# EAGLE schematic BATT_DISP_v6 (EAGLE 9.6.2)
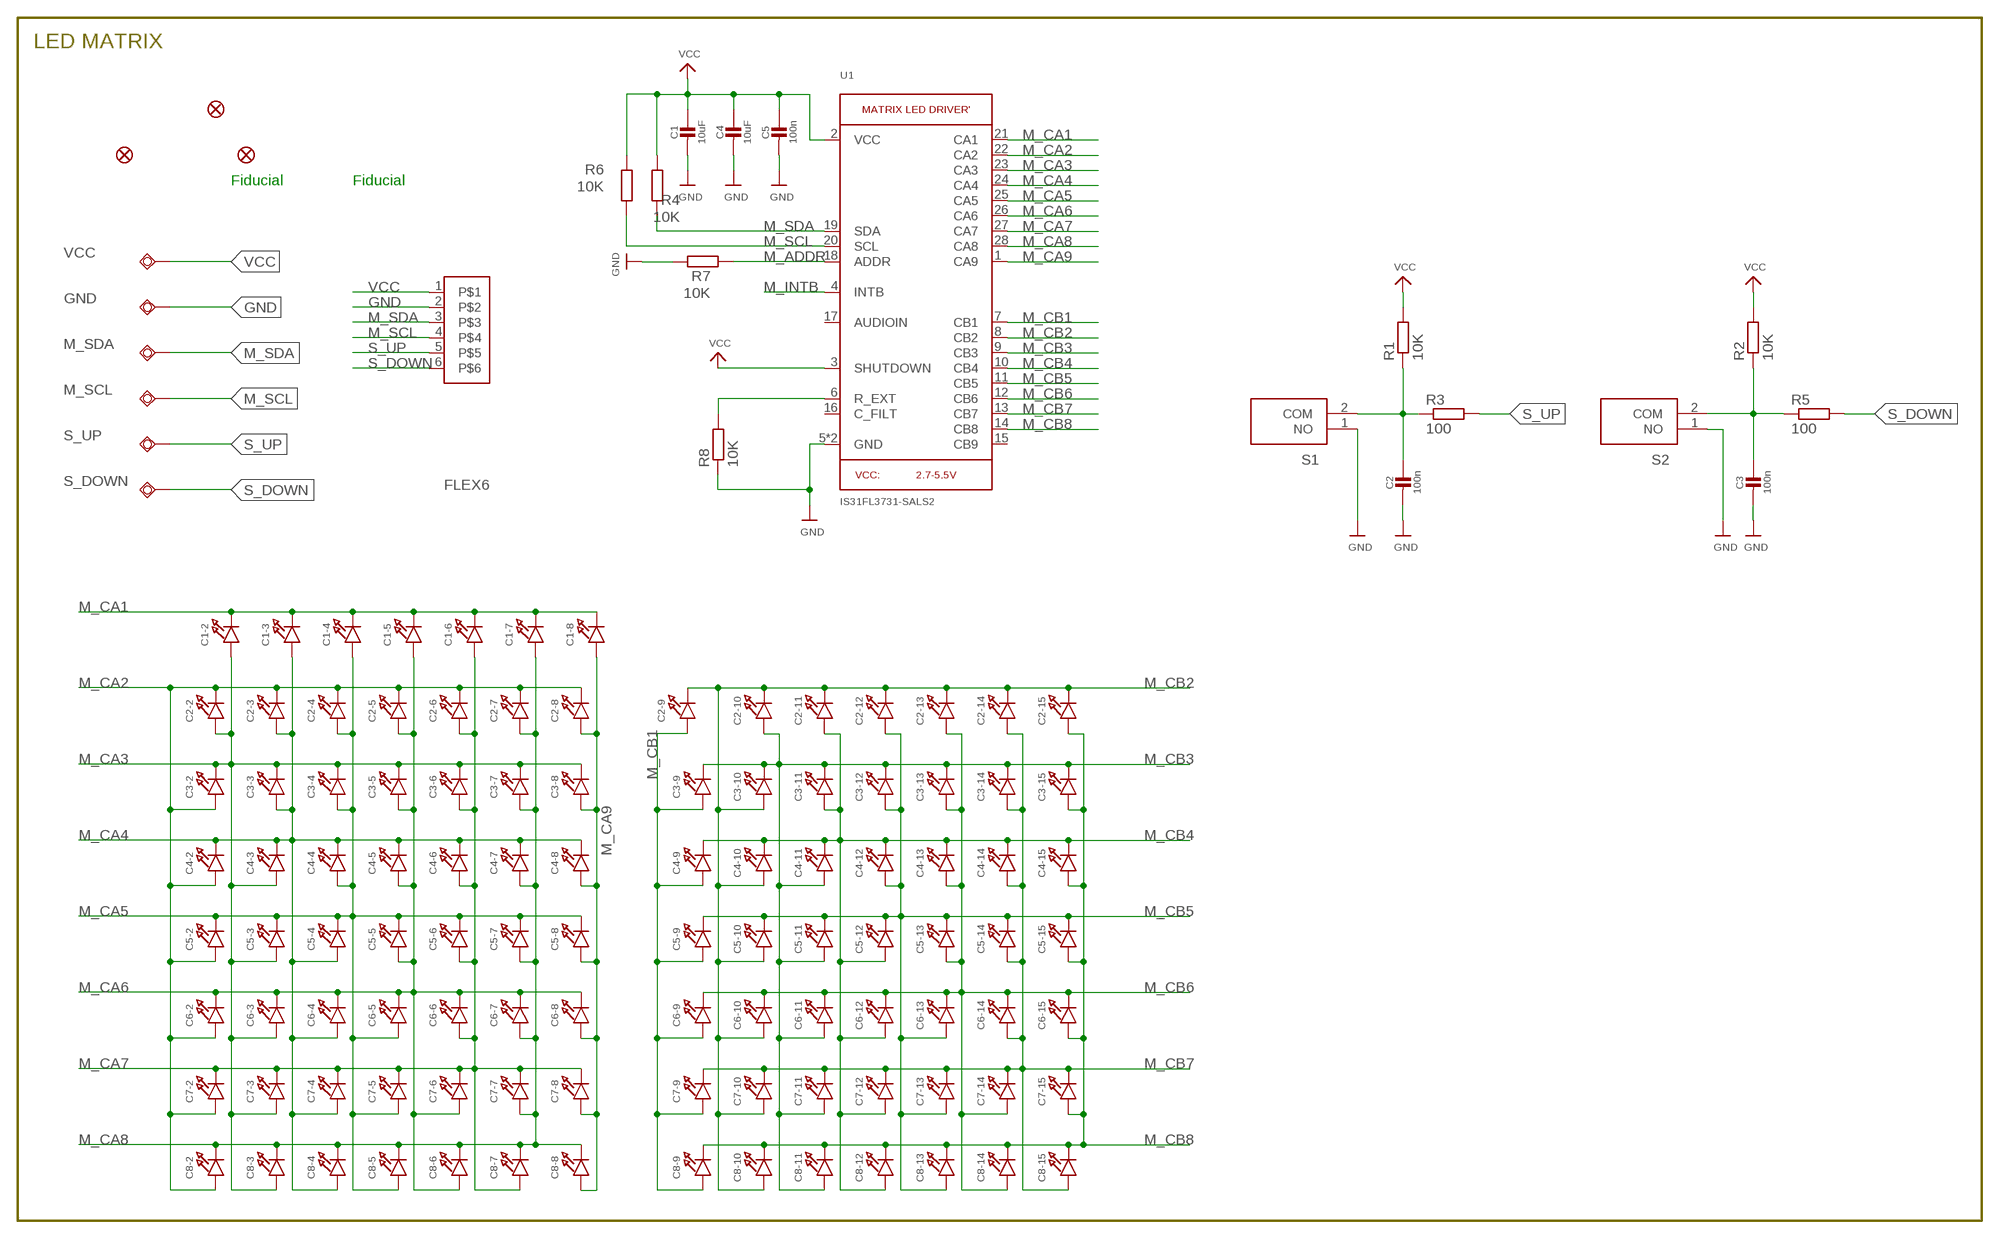
[diagram p0: schematic, sheet 1]

## Parts
C1  10uF  CAP_CERAMIC0805-NOOUTLINE  [0805-NO]
C1-2  LED0402_NOOUTLINE  [CHIPLED_0402_NOOUTLINE]
C1-3  LED0402_NOOUTLINE  [CHIPLED_0402_NOOUTLINE]
C1-4  LED0402_NOOUTLINE  [CHIPLED_0402_NOOUTLINE]
C1-5  LED0402_NOOUTLINE  [CHIPLED_0402_NOOUTLINE]
C1-6  LED0402_NOOUTLINE  [CHIPLED_0402_NOOUTLINE]
C1-7  LED0402_NOOUTLINE  [CHIPLED_0402_NOOUTLINE]
C1-8  LED0402_NOOUTLINE  [CHIPLED_0402_NOOUTLINE]
C2  100n  CAP_CERAMIC0805-NOOUTLINE  [0805-NO]
C2-2  LED0402_NOOUTLINE  [CHIPLED_0402_NOOUTLINE]
C2-3  LED0402_NOOUTLINE  [CHIPLED_0402_NOOUTLINE]
C2-4  LED0402_NOOUTLINE  [CHIPLED_0402_NOOUTLINE]
C2-5  LED0402_NOOUTLINE  [CHIPLED_0402_NOOUTLINE]
C2-6  LED0402_NOOUTLINE  [CHIPLED_0402_NOOUTLINE]
C2-7  LED0402_NOOUTLINE  [CHIPLED_0402_NOOUTLINE]
C2-8  LED0402_NOOUTLINE  [CHIPLED_0402_NOOUTLINE]
C2-9  LED0402_NOOUTLINE  [CHIPLED_0402_NOOUTLINE]
C2-10  LED0402_NOOUTLINE  [CHIPLED_0402_NOOUTLINE]
C2-11  LED0402_NOOUTLINE  [CHIPLED_0402_NOOUTLINE]
C2-12  LED0402_NOOUTLINE  [CHIPLED_0402_NOOUTLINE]
C2-13  LED0402_NOOUTLINE  [CHIPLED_0402_NOOUTLINE]
C2-14  LED0402_NOOUTLINE  [CHIPLED_0402_NOOUTLINE]
C2-15  LED0402_NOOUTLINE  [CHIPLED_0402_NOOUTLINE]
C3  100n  CAP_CERAMIC0805-NOOUTLINE  [0805-NO]
C3-2  LED0402_NOOUTLINE  [CHIPLED_0402_NOOUTLINE]
C3-3  LED0402_NOOUTLINE  [CHIPLED_0402_NOOUTLINE]
C3-4  LED0402_NOOUTLINE  [CHIPLED_0402_NOOUTLINE]
C3-5  LED0402_NOOUTLINE  [CHIPLED_0402_NOOUTLINE]
C3-6  LED0402_NOOUTLINE  [CHIPLED_0402_NOOUTLINE]
C3-7  LED0402_NOOUTLINE  [CHIPLED_0402_NOOUTLINE]
C3-8  LED0402_NOOUTLINE  [CHIPLED_0402_NOOUTLINE]
C3-9  LED0402_NOOUTLINE  [CHIPLED_0402_NOOUTLINE]
C3-10  LED0402_NOOUTLINE  [CHIPLED_0402_NOOUTLINE]
C3-11  LED0402_NOOUTLINE  [CHIPLED_0402_NOOUTLINE]
C3-12  LED0402_NOOUTLINE  [CHIPLED_0402_NOOUTLINE]
C3-13  LED0402_NOOUTLINE  [CHIPLED_0402_NOOUTLINE]
C3-14  LED0402_NOOUTLINE  [CHIPLED_0402_NOOUTLINE]
C3-15  LED0402_NOOUTLINE  [CHIPLED_0402_NOOUTLINE]
C4  10uF  CAP_CERAMIC0805-NOOUTLINE  [0805-NO]
C4-2  LED0402_NOOUTLINE  [CHIPLED_0402_NOOUTLINE]
C4-3  LED0402_NOOUTLINE  [CHIPLED_0402_NOOUTLINE]
C4-4  LED0402_NOOUTLINE  [CHIPLED_0402_NOOUTLINE]
C4-5  LED0402_NOOUTLINE  [CHIPLED_0402_NOOUTLINE]
C4-6  LED0402_NOOUTLINE  [CHIPLED_0402_NOOUTLINE]
C4-7  LED0402_NOOUTLINE  [CHIPLED_0402_NOOUTLINE]
C4-8  LED0402_NOOUTLINE  [CHIPLED_0402_NOOUTLINE]
C4-9  LED0402_NOOUTLINE  [CHIPLED_0402_NOOUTLINE]
C4-10  LED0402_NOOUTLINE  [CHIPLED_0402_NOOUTLINE]
C4-11  LED0402_NOOUTLINE  [CHIPLED_0402_NOOUTLINE]
C4-12  LED0402_NOOUTLINE  [CHIPLED_0402_NOOUTLINE]
C4-13  LED0402_NOOUTLINE  [CHIPLED_0402_NOOUTLINE]
C4-14  LED0402_NOOUTLINE  [CHIPLED_0402_NOOUTLINE]
C4-15  LED0402_NOOUTLINE  [CHIPLED_0402_NOOUTLINE]
C5  100n  CAP_CERAMIC0805-NOOUTLINE  [0805-NO]
C5-2  LED0402_NOOUTLINE  [CHIPLED_0402_NOOUTLINE]
C5-3  LED0402_NOOUTLINE  [CHIPLED_0402_NOOUTLINE]
C5-4  LED0402_NOOUTLINE  [CHIPLED_0402_NOOUTLINE]
C5-5  LED0402_NOOUTLINE  [CHIPLED_0402_NOOUTLINE]
C5-6  LED0402_NOOUTLINE  [CHIPLED_0402_NOOUTLINE]
C5-7  LED0402_NOOUTLINE  [CHIPLED_0402_NOOUTLINE]
C5-8  LED0402_NOOUTLINE  [CHIPLED_0402_NOOUTLINE]
C5-9  LED0402_NOOUTLINE  [CHIPLED_0402_NOOUTLINE]
C5-10  LED0402_NOOUTLINE  [CHIPLED_0402_NOOUTLINE]
C5-11  LED0402_NOOUTLINE  [CHIPLED_0402_NOOUTLINE]
C5-12  LED0402_NOOUTLINE  [CHIPLED_0402_NOOUTLINE]
C5-13  LED0402_NOOUTLINE  [CHIPLED_0402_NOOUTLINE]
C5-14  LED0402_NOOUTLINE  [CHIPLED_0402_NOOUTLINE]
C5-15  LED0402_NOOUTLINE  [CHIPLED_0402_NOOUTLINE]
C6-2  LED0402_NOOUTLINE  [CHIPLED_0402_NOOUTLINE]
C6-3  LED0402_NOOUTLINE  [CHIPLED_0402_NOOUTLINE]
C6-4  LED0402_NOOUTLINE  [CHIPLED_0402_NOOUTLINE]
C6-5  LED0402_NOOUTLINE  [CHIPLED_0402_NOOUTLINE]
C6-6  LED0402_NOOUTLINE  [CHIPLED_0402_NOOUTLINE]
C6-7  LED0402_NOOUTLINE  [CHIPLED_0402_NOOUTLINE]
C6-8  LED0402_NOOUTLINE  [CHIPLED_0402_NOOUTLINE]
C6-9  LED0402_NOOUTLINE  [CHIPLED_0402_NOOUTLINE]
C6-10  LED0402_NOOUTLINE  [CHIPLED_0402_NOOUTLINE]
C6-11  LED0402_NOOUTLINE  [CHIPLED_0402_NOOUTLINE]
C6-12  LED0402_NOOUTLINE  [CHIPLED_0402_NOOUTLINE]
C6-13  LED0402_NOOUTLINE  [CHIPLED_0402_NOOUTLINE]
C6-14  LED0402_NOOUTLINE  [CHIPLED_0402_NOOUTLINE]
C6-15  LED0402_NOOUTLINE  [CHIPLED_0402_NOOUTLINE]
C7-2  LED0402_NOOUTLINE  [CHIPLED_0402_NOOUTLINE]
C7-3  LED0402_NOOUTLINE  [CHIPLED_0402_NOOUTLINE]
C7-4  LED0402_NOOUTLINE  [CHIPLED_0402_NOOUTLINE]
C7-5  LED0402_NOOUTLINE  [CHIPLED_0402_NOOUTLINE]
C7-6  LED0402_NOOUTLINE  [CHIPLED_0402_NOOUTLINE]
C7-7  LED0402_NOOUTLINE  [CHIPLED_0402_NOOUTLINE]
C7-8  LED0402_NOOUTLINE  [CHIPLED_0402_NOOUTLINE]
C7-9  LED0402_NOOUTLINE  [CHIPLED_0402_NOOUTLINE]
C7-10  LED0402_NOOUTLINE  [CHIPLED_0402_NOOUTLINE]
C7-11  LED0402_NOOUTLINE  [CHIPLED_0402_NOOUTLINE]
C7-12  LED0402_NOOUTLINE  [CHIPLED_0402_NOOUTLINE]
C7-13  LED0402_NOOUTLINE  [CHIPLED_0402_NOOUTLINE]
C7-14  LED0402_NOOUTLINE  [CHIPLED_0402_NOOUTLINE]
C7-15  LED0402_NOOUTLINE  [CHIPLED_0402_NOOUTLINE]
C8-2  LED0402_NOOUTLINE  [CHIPLED_0402_NOOUTLINE]
C8-3  LED0402_NOOUTLINE  [CHIPLED_0402_NOOUTLINE]
C8-4  LED0402_NOOUTLINE  [CHIPLED_0402_NOOUTLINE]
C8-5  LED0402_NOOUTLINE  [CHIPLED_0402_NOOUTLINE]
C8-6  LED0402_NOOUTLINE  [CHIPLED_0402_NOOUTLINE]
C8-7  LED0402_NOOUTLINE  [CHIPLED_0402_NOOUTLINE]
C8-8  LED0402_NOOUTLINE  [CHIPLED_0402_NOOUTLINE]
C8-9  LED0402_NOOUTLINE  [CHIPLED_0402_NOOUTLINE]
C8-10  LED0402_NOOUTLINE  [CHIPLED_0402_NOOUTLINE]
C8-11  LED0402_NOOUTLINE  [CHIPLED_0402_NOOUTLINE]
C8-12  LED0402_NOOUTLINE  [CHIPLED_0402_NOOUTLINE]
C8-13  LED0402_NOOUTLINE  [CHIPLED_0402_NOOUTLINE]
C8-14  LED0402_NOOUTLINE  [CHIPLED_0402_NOOUTLINE]
C8-15  LED0402_NOOUTLINE  [CHIPLED_0402_NOOUTLINE]
FD1  FIDUCIALUFIDUCIAL  [FIDUCIAL-MICRO]
FD2  FIDUCIAL""  [FIDUCIAL_1MM]
FD3  FIDUCIAL""  [FIDUCIAL_1MM]
GND  TESTPAD_TPSQB1,27  [TESTPAD_B1,27]
K1  FLEX6  [FLEX6]
M_SCL  TESTPAD_TPSQB1,27  [TESTPAD_B1,27]
M_SDA  TESTPAD_TPSQB1,27  [TESTPAD_B1,27]
R1  10K  R-EU_R0603  [R0603]
R2  10K  R-EU_R0603  [R0603]
R3  100  R-EU_R0603  [R0603]
R4  10K  R-EU_R0603  [R0603]
R5  100  R-EU_R0603  [R0603]
R6  10K  R-EU_R0603  [R0603]
R7  10K  R-EU_R0603  [R0603]
R8  10K  R-EU_R0603  [R0603]
S1  KXT311LHS  [KXT311LHS]
S2  KXT311LHS  [KXT311LHS]
S_DOWN  TESTPAD_TPSQB1,27  [TESTPAD_B1,27]
S_UP  TESTPAD_TPSQB1,27  [TESTPAD_B1,27]
U1  IS31FL3731-SALS2  IS31FL3731QFN  [QFN28_4MM_0.4MM]
VCC  TESTPAD_TPSQB1,27  [TESTPAD_B1,27]

## Nets
GND: C1.2 C2.2 C3.2 C4.2 C5.2 GND.TP K1.2 R7.2 R8.1 S1.1(NO) S2.1(NO) U1.5(GND) U1.THERMAL(GND)
M_ADDR: R7.1 U1.18(ADDR)
M_CA1: C1-2.C C1-3.C C1-4.C C1-5.C C1-6.C C1-7.C C1-8.C U1.21(CA1)
M_CA2: C2-2.C C2-3.C C2-4.C C2-5.C C2-6.C C2-7.C C2-8.C C3-2.A C4-2.A C5-2.A C6-2.A C7-2.A C8-2.A U1.22(CA2)
M_CA3: C1-2.A C2-2.A C3-2.C C3-3.C C3-4.C C3-5.C C3-6.C C3-7.C C3-8.C C4-3.A C5-3.A C6-3.A C7-3.A C8-3.A U1.23(CA3)
M_CA4: C1-3.A C2-3.A C3-3.A C4-2.C C4-3.C C4-4.C C4-5.C C4-6.C C4-7.C C4-8.C C5-4.A C6-4.A C7-4.A C8-4.A U1.24(CA4)
M_CA5: C1-4.A C2-4.A C3-4.A C4-4.A C5-2.C C5-3.C C5-4.C C5-5.C C5-6.C C5-7.C C5-8.C C6-5.A C7-5.A C8-5.A U1.25(CA5)
M_CA6: C1-5.A C2-5.A C3-5.A C4-5.A C5-5.A C6-2.C C6-3.C C6-4.C C6-5.C C6-6.C C6-7.C C6-8.C C7-6.A C8-6.A U1.26(CA6)
M_CA7: C1-6.A C2-6.A C3-6.A C4-6.A C5-6.A C6-6.A C7-2.C C7-3.C C7-4.C C7-5.C C7-6.C C7-7.C C7-8.C C8-7.A U1.27(CA7)
M_CA8: C1-7.A C2-7.A C3-7.A C4-7.A C5-7.A C6-7.A C7-7.A C8-2.C C8-3.C C8-4.C C8-5.C C8-6.C C8-7.C C8-8.C U1.28(CA8)
M_CA9: C1-8.A C2-8.A C3-8.A C4-8.A C5-8.A C6-8.A C7-8.A C8-8.A U1.1(CA9)
M_CB1: C2-9.A C3-9.A C4-9.A C5-9.A C6-9.A C7-9.A C8-9.A U1.7(CB1)
M_CB2: C2-9.C C2-10.C C2-11.C C2-12.C C2-13.C C2-14.C C2-15.C C3-10.A C4-10.A C5-10.A C6-10.A C7-10.A C8-10.A U1.8(CB2)
M_CB3: C2-10.A C3-9.C C3-10.C C3-11.C C3-12.C C3-13.C C3-14.C C3-15.C C4-11.A C5-11.A C6-11.A C7-11.A C8-11.A U1.9(CB3)
M_CB4: C2-11.A C3-11.A C4-9.C C4-10.C C4-11.C C4-12.C C4-13.C C4-14.C C4-15.C C5-12.A C6-12.A C7-12.A C8-12.A U1.10(CB4)
M_CB5: C2-12.A C3-12.A C4-12.A C5-9.C C5-10.C C5-11.C C5-12.C C5-13.C C5-14.C C5-15.C C6-13.A C7-13.A C8-13.A U1.11(CB5)
M_CB6: C2-13.A C3-13.A C4-13.A C5-13.A C6-9.C C6-10.C C6-11.C C6-12.C C6-13.C C6-14.C C6-15.C C7-14.A C8-14.A U1.12(CB6)
M_CB7: C2-14.A C3-14.A C4-14.A C5-14.A C6-14.A C7-9.C C7-10.C C7-11.C C7-12.C C7-13.C C7-14.C C7-15.C C8-15.A U1.13(CB7)
M_CB8: C2-15.A C3-15.A C4-15.A C5-15.A C6-15.A C7-15.A C8-9.C C8-10.C C8-11.C C8-12.C C8-13.C C8-14.C C8-15.C U1.14(CB8)
M_INTB: U1.4(INTB)
M_SCL: K1.4 M_SCL.TP R6.1 U1.20(SCL)
M_SDA: K1.3 M_SDA.TP R4.1 U1.19(SDA)
N$1: C3.1 R2.1 R5.1 S2.2(COM)
N$2: C2.1 R1.1 R3.1 S1.2(COM)
R_EXT: R8.2 U1.6(R_EXT)
S_DOWN: K1.6 R5.2 S_DOWN.TP
S_UP: K1.5 R3.2 S_UP.TP
VCC: C1.1 C4.1 C5.1 K1.1 R1.2 R2.2 R4.2 R6.2 U1.2(VCC) U1.3(SHUTDOWN) VCC.TP
Unconnected: U1.15(CB9) U1.16(C_FILT) U1.17(AUDIOIN)

## Notes on the sheet
- LED MATRIX
- Fiducial | Fiducial

## Library data of the parts
C1-C5 = microbuilder:CAP_CERAMIC: Ceramic Capacitors For new designs, use the packages preceded by an '_' character since they are more reliable: The following footprints should be used on most boards: _0402 - Standard footprint for regular board layouts _0603 - Standard footprint for regular board layouts _0805 - Standard footprint for regular board layouts _1206 - Standard footprint for regular board layouts For extremely tight-pitch boards where space is at a premium, the following 'micro-pitch' footprints can be used (smaller pads, no silkscreen outline, etc.): _0402MP - Micro-pitch footprint for very dense/compact boards _0603MP - Micro-pitch footprint for very dense/compact boards _0805MP - Micro-pitch footprint for very dense/compact boards _1206MP - Micro-pitch footprint for very dense/compact boards
C1-2-C1-8 C2-2-C2-15 C3-2-C3-15 C4-2-C4-15 C5-2-C5-15 C6-2-C6-15 C7-2-C7-15 C8-2-C8-15 = microbuilder:LED: LED 0603 - 0603 Surface Mount Package 2mA: Green LED - Low Power (3.9mcd, 2ma, 1.7Vf) - Digikey: 475-2709-2-ND Orange LED - Low Power (9.8mcd, 2ma, 1.8Vf) - Digikey: 475-1194-2-ND Red LED - Low Power (5mcd, 2ma, 1.8Vf) - Digikey: 475-1195-2-ND Yellow LED - Low Power (7mcd, 2ma, 1.8Vf) - Digikey: 475-1196-2-ND 5mA: Blue LED - Low Power (17mcd, 5ma, 2.9Vf) - Digikey: LNJ937W8CRACT-ND 0805 - 0805 Surface Mount Package 2mA: Red LED (8.8mcd, 2mA, 1.8Vf, Clear) - Low Power [Digikey: 475-2510-1-ND] Green LED (5mcd, 2mA, 1.8Vf, Clear) - Low Power [Digikey: 475-2730-1-ND] Yellow LED (11.3mcd, 2mA, 1.8Vf, Clear) - Low Power [Digikey: 475-2555-1-ND] 20mA: Red LED (104mcd, 20mA, Diffused) - LS R976 [Digikey: 475-1278-6-ND] Red LED (12mcd, 20mA, 2.0Vf, Clear) - APT2012EC [Digikey: 754-1128-1-ND] Green LED (15mcd, 20mA, 2.2Vf, Clear) - APT2012GC [Digikey: 754-1131-1-ND] Orange LED (160mcd, 20mA, 2.1Vf, Clear) - APT2012SECK [Digikey: 754-1130-1-ND] 1206 - 1206 Surface Mount Package Green LED (26mcd, 20mA, Diffused) - LG N971 [Digikey: 475-1407-6-ND] Red LED (15mcd, 20mA, Diffused) - LH N974 [Digikey: 475-1416-6-ND] Cree - Cree High-Power Surface Mount LEDs XPEBWT-L1-0000-00D50 - White 111lm 350mA 2.9Vf 6200K 110° XTEAWT-00-0000-00000LEE3 - White 114lm 350mA 2.85Vf 5000K 115° Everlight - Everlight 45-21 Series Surface Mount LEDs 45-21/QK2C-B2832AC2CB2/2T - Warm White 2000mcd 20mA 3.25Vf 3050K 120° 45-21/LK2C-B38452C4CB2/2T - Nuetral White 2000mcd 20mA 3.25Vf 4150K 120° 45-21/LK2C-B50634C6CB2/2T - Cold White 2200mcd 20mA 3.25Vf 5650K 120° PLCC2 Reverse Mount LS T77K-J1L2-1-0-2-R18-Z - Red 11.25mcd 2mA 1.8Vf 630nm 120° LO T77K-L1M2-24-Z - Orange 19.6mcd 2mA 1.8Vf 606nm 120° LY T77K-K2M1-26-Z - Yellow 15.7mcd 2mA 1.8Vf 587nm 120°
FD1 = SparkFun-Aesthetics:FIDUCIAL: Fiducial Alignment Points
FD2 FD3 = microbuilder:FIDUCIAL: Fiducial Alignment Points; BOM: EXCLUDE
GND M_SCL M_SDA S_DOWN S_UP VCC = BeagleBone_Blue_R3:TESTPAD_TPSQ: Test pad
K1 = Flex_3mm:FLEX6: WR-FPC 1mm SMT Horiz. Bot. Contact Hinge type WR-FPC 1mm 06 pins Hinge type SMT Horizontal Bottom Contact ;=>Code : Con_FPC_ZIF_1.00_6861xx148922_686106148922 <http://katalog.we-online.de/media/images/eican/Con_FPC_ZIF_1.00_686110148922_pf2.jpg> Details see: http://katalog.we-online.de/em/datasheet/6861xx148922.pdf Created 2014-10-08, Karrer Zheng 2014 (C) Wurth Elektronik
R1-R8 = rcl:R-EU_: RESISTOR, European symbol; SPICEPREFIX: R
S1 S2 = switch momentary CK KXT311LHS:KXT311LHS: Tactile Switches 20mA 15VDC 100gf 0.6mm SPST NO SMT Source: Datasheet <https://datasheet.lcsc.com/szlcsc/C-K-KXT311LHS_C221820.pdf>; DESCRIPTION: Tactile Switches 20mA 15VDC 100gf 0.6mm SPST NO SMT; HEIGHT: 0.7mm; MANUFACTURER_NAME: C & K COMPONENTS; MANUFACTURER_PART_NUMBER: KXT311LHS; MOUSER_PART_NUMBER: 611-KXT311LHS; MOUSER_PRICE-STOCK: https://www.mouser.co.uk/ProductDetail/CK/KXT311LHS/?qs=%2FQ2qp2Z%2FWFxZqSWVDr5IpA%3D%3D
U1 = microbuilder:IS31FL3731: IS31FL3731 PWM LED Matrix Driver